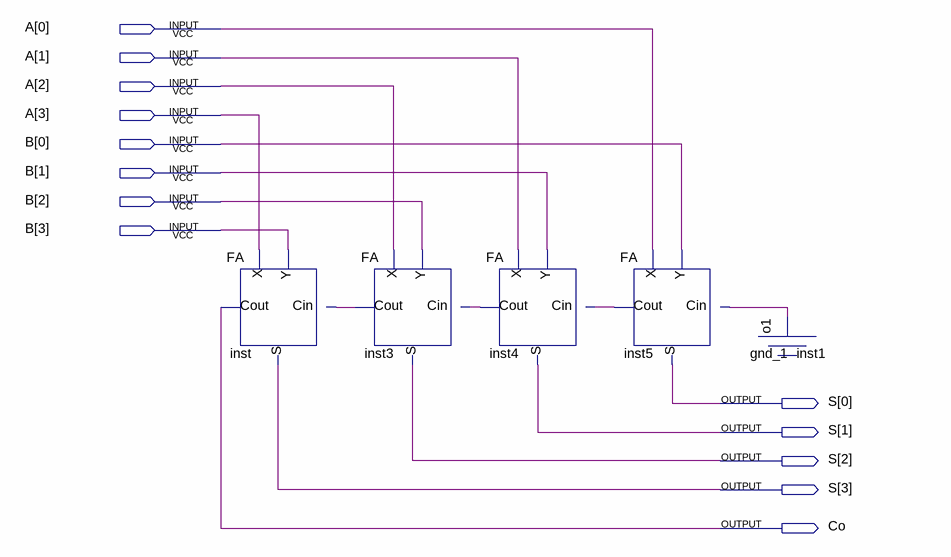
[diagram p0: schematic sheet]
// Quartus schematic FA4.bdf as structural Verilog: 5 symbols, 13 pins
module FA4 (
  input  [3:0] A,
  input  [3:0] B,
  output [3:0] S,
  output Co
);

  wire inst1_o1, inst3_cout, inst4_cout, inst5_cout;

  FA inst (.X(A[3]), .Y(B[3]), .Cin(inst3_cout), .S(S[3]), .Cout(Co));
  FA inst3 (.X(A[2]), .Y(B[2]), .Cin(inst4_cout), .S(S[2]), .Cout(inst3_cout));
  FA inst4 (.X(A[1]), .Y(B[1]), .Cin(inst5_cout), .S(S[1]), .Cout(inst4_cout));
  FA inst5 (.X(A[0]), .Y(B[0]), .Cin(inst1_o1), .S(S[0]), .Cout(inst5_cout));
  gnd_1 inst1 (.o1(inst1_o1));
endmodule
